# EAGLE design ACNode0_3 (EAGLE 6.1)
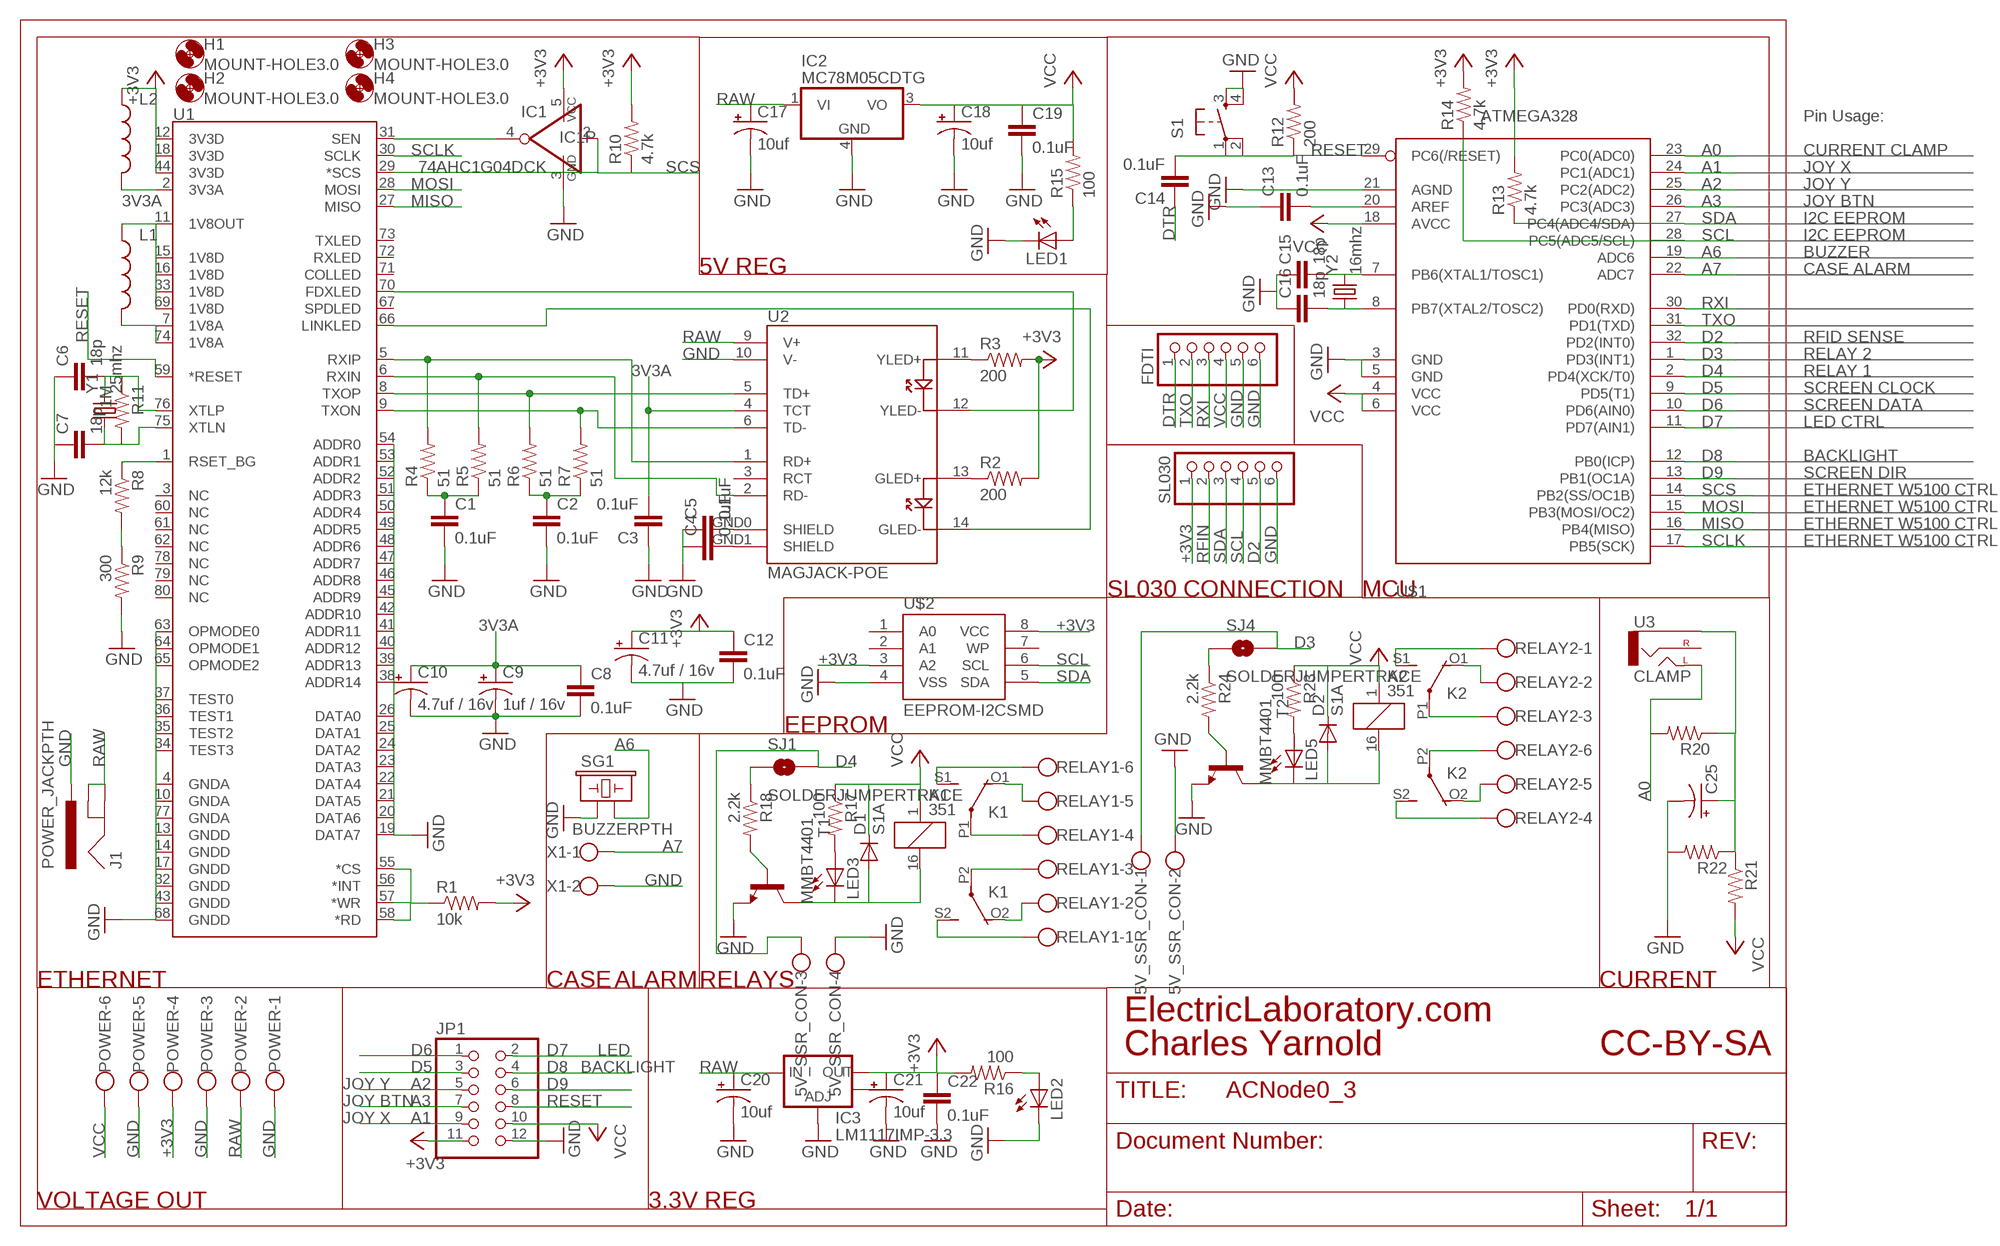
[diagram p0: schematic, sheet 1]

## Parts
5V_SSR_CON  W237-4  [W237-4]
C1  0.1uF  CAP0603-CAP  [0603-CAP]
C2  0.1uF  CAP0603-CAP  [0603-CAP]
C3  0.1uF  CAP0603-CAP  [0603-CAP]
C4  0.1uF  CAP0603-CAP  [0603-CAP]
C5  0.1uF  CAP0603-CAP  [0603-CAP]
C6  18p  CAP0603-CAP  [0603-CAP]
C7  18p  CAP0603-CAP  [0603-CAP]
C8  0.1uF  CAP0603-CAP  [0603-CAP]
C9  1uf / 16v  CAP_POL1206  [EIA3216]
C10  4.7uf / 16v  CAP_POL1206  [EIA3216]
C11  4.7uf / 16v  CAP_POL1206  [EIA3216]
C12  0.1uF  CAP0603-CAP  [0603-CAP]
C13  0.1uF  CAP0603-CAP  [0603-CAP]
C14  0.1uF  CAP0603-CAP  [0603-CAP]
C15  18p  CAP0603-CAP  [0603-CAP]
C16  18p  CAP0603-CAP  [0603-CAP]
C17  10uf  CAP_POL1206  [EIA3216]
C18  10uf  CAP_POL1206  [EIA3216]
C19  0.1uF  CAP0603-CAP  [0603-CAP]
C20  10uf  CAP_POL1206  [EIA3216]
C21  10uf  CAP_POL1206  [EIA3216]
C22  0.1uF  CAP0603-CAP  [0603-CAP]
C25  CAP_POL1206  [EIA3216]
D1  S1A  DIODE-DO-214AC  [DO-214AC]
D2  S1A  DIODE-DO-214AC  [DO-214AC]
FDTI  PINHD-1X6  [1X06]
H1  MOUNT-HOLE3.0  [3,0]
H2  MOUNT-HOLE3.0  [3,0]
H3  MOUNT-HOLE3.0  [3,0]
H4  MOUNT-HOLE3.0  [3,0]
IC1  74AHC1G04DCK  [SC70-5]
IC2  MC78M05CDTG  [DPACK_3]
IC3  LM1117IMP-3.3  V_REG_LM1117SOT223  [SOT223]
J1  POWER_JACKPTH  [POWER_JACK_PTH]
JP1  PINHD-2X6  [2X06]
K1  351  [351]
K2  351  [351]
L1  INDUCTOR1206H*  [INDUCTOR-1206]
L2  INDUCTOR1206H*  [INDUCTOR-1206]
LED1  LED0603  [LED-0603]
LED2  LED0603  [LED-0603]
LED3  LED0603  [LED-0603]
LED5  LED0603  [LED-0603]
POWER  W237-6  [W237-6]
R1  10k  RESISTOR0603-RES  [0603-RES]
R2  200  RESISTOR0603-RES  [0603-RES]
R3  200  RESISTOR0603-RES  [0603-RES]
R4  51  RESISTOR0603-RES  [0603-RES]
R5  51  RESISTOR0603-RES  [0603-RES]
R6  51  RESISTOR0603-RES  [0603-RES]
R7  51  RESISTOR0603-RES  [0603-RES]
R8  12k  RESISTOR0603-RES  [0603-RES]
R9  300  RESISTOR0603-RES  [0603-RES]
R10  4.7k  RESISTOR0603-RES  [0603-RES]
R11  1M  RESISTOR0603-RES  [0603-RES]
R12  200  RESISTOR0603-RES  [0603-RES]
R13  4.7k  RESISTOR0603-RES  [0603-RES]
R14  4.7k  RESISTOR0603-RES  [0603-RES]
R15  100  RESISTOR0603-RES  [0603-RES]
R16  100  RESISTOR0603-RES  [0603-RES]
R17  100  RESISTOR0603-RES  [0603-RES]
R18  2.2k  RESISTOR0603-RES  [0603-RES]
R20  RESISTOR0603-RES  [0603-RES]
R21  RESISTOR0603-RES  [0603-RES]
R22  RESISTOR0603-RES  [0603-RES]
R23  100  RESISTOR0603-RES  [0603-RES]
R24  2.2k  RESISTOR0603-RES  [0603-RES]
RELAY1  W237-6  [W237-6]
RELAY2  W237-6  [W237-6]
S1  TAC_SWITCHSMD  [TACTILE_SWITCH_SMD]
SG1  BUZZERPTH  [BUZZER-12MM]
SJ1  SOLDERJUMPERTRACE  [SJ_2S-TRACE]
SJ4  SOLDERJUMPERTRACE  [SJ_2S-TRACE]
SL030  PINHD-1X6  [1X06]
T1  MMBT4401  MMBT4401LT1-NPN-SOT23-BEC  [SOT23-BEC]
T2  MMBT4401  MMBT4401LT1-NPN-SOT23-BEC  [SOT23-BEC]
U1  W5100  [LQFP-80]
U2  MAGJACK-POE  [MAGJACK-POE]
U3  CLAMP  AUDIO-JACKPTH  [AUDIO-JACK]
U$1  ATMEGA328  AVR-MEGA8-AI  [TQFP32-08]
U$2  EEPROM-I2CSMD  [SO08]
X1  W237-102  [W237-102]
Y1  25mhz  CRYSTALSMD  [HC49UP]
Y2  16mhz  CRYSTALSMD  [HC49UP]

## Nets
3V3A: C3.2 C8.1 C9.A(+) C10.A(+) L2.P$2 U1.2(3V3A) U2.4(TCT)
+3V3: C11.A(+) C12.1 C21.A(+) C22.1 IC1.5(VCC) IC3.2(OUT) JP1.11 L2.P$1 POWER.4 R1.2 R2.2 R3.2 R10.2 R13.2 R14.2 R16.2 SL030.1 U1.12(3V3D) U1.18(3V3D) U1.44(3V3D) U$2.3(A2) U$2.8(VCC)
A0: R20.2 U3.TIP(LEFT) U$1.23(PC0(ADC0))
A1: JP1.9 U$1.24(PC1(ADC1))
A2: JP1.5 U$1.25(PC2(ADC2))
A3: JP1.7 U$1.26(PC3(ADC3))
A6: SG1.- U$1.19(ADC6)
A7: U$1.22(ADC7) X1.1
D2: SL030.5 U$1.32(PD2(INT0))
D3: 5V_SSR_CON.1 SJ4.2 U$1.1(PD3(INT1))
D4: 5V_SSR_CON.3 SJ1.2 U$1.2(PD4(XCK/T0))
D5: JP1.3 U$1.9(PD5(T1))
D6: JP1.1 U$1.10(PD6(AIN0))
D7: JP1.2 U$1.11(PD7(AIN1))
D8: JP1.4 U$1.12(PB0(ICP))
D9: JP1.6 U$1.13(PB1(OC1A))
DTR: C14.1 FDTI.1
GND: 5V_SSR_CON.2 5V_SSR_CON.4 C1.2 C2.2 C3.1 C4.1 C5.1 C6.1 C7.1 C8.2 C9.C(-) C10.C(-) C11.C(-) C12.2 C13.1 C15.1 C16.1 C17.C(-) C18.C(-) C19.2 C20.C(-) C21.C(-) C22.2 C25.C(-) FDTI.5 FDTI.6 IC1.3(GND) IC2.4(GND) IC3.1(ADJ) J1.PWR JP1.12 LED1.C LED2.C POWER.1 POWER.3 POWER.5 R9.2 R22.2 S1.3 S1.4 SG1.+ SL030.6 T1.E T2.E U1.4(GNDA) U1.10(GNDA) U1.13(GNDD) U1.14(GNDD) U1.17(GNDD) U1.19(DATA7) U1.20(DATA6) U1.21(DATA5) U1.22(DATA4) U1.23(DATA3) U1.24(DATA2) U1.25(DATA1) U1.26(DATA0) U1.32(GNDD) U1.34(TEST3) U1.35(TEST2) U1.36(TEST1) U1.37(TEST0) U1.38(ADDR14) U1.39(ADDR13) U1.40(ADDR12) U1.41(ADDR11) U1.42(ADDR10) U1.43(GNDD) U1.45(ADDR9) U1.46(ADDR8) U1.47(ADDR7) U1.48(ADDR6) U1.49(ADDR5) U1.50(ADDR4) U1.51(ADDR3) U1.52(ADDR2) U1.53(ADDR1) U1.54(ADDR0) U1.63(OPMODE0) U1.64(OPMODE1) U1.65(OPMODE2) U1.68(GNDD) U1.77(GNDA) U2.10(V-) U$1.3(GND) U$1.5(GND) U$1.21(AGND) U$2.4(VSS) X1.2
MISO: U1.27(MISO) U$1.16(PB4(MISO))
MOSI: U1.28(MOSI) U$1.15(PB3(MOSI/OC2))
N$1: IC1.4(O) U1.31(SEN)
N$2: C13.2 U$1.20(AREF)
N$3: C2.1 R6.1 R7.1
N$4: C1.1 R4.1 R5.1
N$5: L1.P$2 U1.7(1V8A) U1.74(1V8A)
N$6: L1.P$1 U1.11(1V8OUT) U1.15(1V8D) U1.16(1V8D) U1.33(1V8D) U1.69(1V8D)
N$7: R1.1 U1.55(*CS) U1.57(*WR) U1.58(*RD)
N$8: R8.2 R9.1
N$9: R6.2 U1.8(TXOP) U2.5(TD+)
N$10: R7.2 U1.9(TXON) U2.6(TD-)
N$11: R4.2 U1.5(RXIP) U2.1(RD+)
N$12: R5.2 U1.6(RXIN) U2.2(RD-)
N$13: R3.1 U2.11(YLED+)
N$14: R2.1 U2.13(GLED+)
N$15: R8.1 U1.1(RSET_BG)
N$16: U1.70(FDXLED) U2.12(YLED-)
N$17: U1.66(LINKLED) U2.14(GLED-)
N$18: C5.2 U2.GND0(SHIELD)
N$19: C4.2 U2.GND1(SHIELD)
N$20: C7.2 R11.2 U1.75(XTLN) Y1.1
N$21: C6.2 R11.1 U1.76(XTLP) Y1.2
N$22: C15.2 U$1.7(PB6(XTAL1/TOSC1)) Y2.2
N$23: K2.P1(2:P) RELAY2.3
N$24: C16.2 U$1.8(PB7(XTAL2/TOSC2)) Y2.1
N$25: K1.S2(3:S) RELAY1.1
N$26: LED1.A R15.1
N$27: K1.O2(3:O) RELAY1.2
N$28: LED2.A R16.1
N$29: K1.P2(3:P) RELAY1.3
N$30: K1.P1(2:P) RELAY1.4
N$31: K1.O1(2:O) RELAY1.5
N$32: K1.S1(2:S) RELAY1.6
N$33: LED3.A R17.2
N$34: D1.A K1.16 LED3.C T1.C
N$35: R18.2 T1.B
N$36: K2.P2(3:P) RELAY2.6
N$37: R18.1 SJ1.1
N$40: C25.A(+) R20.1 R21.1 R22.1 U3.SLEEVE
N$42: K2.S2(3:S) RELAY2.4
N$43: K2.O2(3:O) RELAY2.5
N$46: K2.O1(2:O) RELAY2.2
N$47: K2.S1(2:S) RELAY2.1
N$48: LED5.A R23.2
N$49: D2.A K2.16 LED5.C T2.C
N$50: R24.2 T2.B
N$51: R24.1 SJ4.1
RAW: C17.A(+) C20.A(+) IC2.1(VI) IC3.3(IN) J1.GND J1.GNDBREAK POWER.2 U2.9(V+)
RESET: C14.2 JP1.8 R12.1 S1.1 S1.2 U1.59(*RESET) U$1.29(PC6(/RESET))
RFIN: SL030.2
RXI: FDTI.3 U$1.30(PD0(RXD))
SCL: R14.1 SL030.4 U$1.28(PC5(ADC5/SCL)) U$2.6(SCL)
SCLK: U1.30(SCLK) U$1.17(PB5(SCK))
SCS: IC1.2(I) R10.1 U1.29(*SCS) U$1.14(PB2(SS/OC1B))
SDA: R13.1 SL030.3 U$1.27(PC4(ADC4/SDA)) U$2.5(SDA)
TXO: FDTI.2 U$1.31(PD1(TXD))
VCC: C18.A(+) C19.1 D1.C D2.C FDTI.4 IC2.3(VO) JP1.10 K1.1 K2.1 POWER.6 R12.2 R15.2 R17.1 R21.2 R23.1 U$1.4(VCC) U$1.6(VCC) U$1.18(AVCC)
Unconnected: IC3.4(OUT) U1.3(NC) U1.56(*INT) U1.60(NC) U1.61(NC) U1.62(NC) U1.67(SPDLED) U1.71(COLLED) U1.72(RXLED) U1.73(TXLED) U1.78(NC) U1.79(NC) U1.80(NC) U2.3(RCT) U3.RING(RIGHT) U$2.1(A0) U$2.2(A1) U$2.7(WP)

## Notes on the sheet
- Pin Usage:
- CURRENT CLAMP
- JOY X
- JOY Y
- JOY BTN
- I2C EEPROM
- I2C EEPROM
- BUZZER
- 5V REG | CASE ALARM
- RFID SENSE
- RELAY 2
- RELAY 1
- SCREEN CLOCK
- SCREEN DATA
- LED CTRL
- BACKLIGHT
- SCREEN DIR
- ETHERNET W5100 CTRL
- ETHERNET W5100 CTRL
- ETHERNET W5100 CTRL
- ETHERNET W5100 CTRL
- SL030 CONNECTION | MCU
- EEPROM
- ETHERNET | CASE | ALARM | RELAYS | CURRENT
- ElectricLaboratory.com
- LED | Charles Yarnold | CC-BY-SA
- BACKLIGHT
- JOY Y
- JOY BTN
- JOY X
- VOLTAGE OUT | 3.3V REG

## Library data of the parts
5V_SSR_CON = con-wago-500:W237-4: WAGO SCREW CLAMP; OC_FARNELL: unknown; OC_NEWARK: unknown
C1-C8 C12-C16 C19 C22 = SparkFun-Passives:CAP: Capacitor Standard 0603 ceramic capacitor, and 0.1" leaded capacitor.
C9-C11 C17 C18 C20 C21 C25 = SparkFun-Passives:CAP_POL: Capacitor Polarized These are standard SMD and PTH capacitors. Normally 10uF, 47uF, and 100uF in electrolytic and tantalum varieties. Always verify the external diameter of the through hole cap, it varies with capacity, voltage, and manufacturer. The EIA devices should be standard.
D1 D2 = diode:DIODE-: DIODE
FDTI SL030 = pinhead:PINHD-1X6: PIN HEADER
H1-H4 = holes:MOUNT-HOLE: MOUNTING HOLE with drill center marker
IC1 = 74xx-little-de:74*1G04: INVERTER Gate
IC2 = linear:MC78M: 500 mA Positive Voltage Regulators Source: Data sheet <http://www.onsemi.com/pub_link/Collateral/MC78M00-D.PDF>
IC3 = SparkFun-PowerIC:V_REG_LM1117: Voltage Regulator LM1117 Standard adjustable voltage regulator but in SMD form. Spark Fun Electronics SKU : COM-00595
J1 = SparkFun-Connectors:POWER_JACK: Power Jack This is the standard 5.5mm barrel jack for power. The PTH is the most common, proven, reliable, footprint. All others are experimental. The Slot footprint only works if the mill layer is transmitted to the PCB fab house so be warned. Spark Fun Electronics SKU : PRT-00119. Mating wall wart : TOL-00298 (and others)
JP1 = pinhead:PINHD-2X6: PIN HEADER
K1 K2 = relay:351: RELAY 2 x switch, Omron; OC_FARNELL: unknown; OC_NEWARK: unknown
L1 L2 = SparkFun-Passives:INDUCTOR: Inductors Basic Inductor/Choke - 0603 and 1206. Footprints are not proven and vary greatly between part numbers.
LED1-LED3 LED5 = SparkFun-LED:LED: LEDs Standard schematic elements and footprints for 5mm, 3mm, 1206, and 0603 sized LEDs. 5mm - Spark Fun Electronics SKU : COM-00529 (and others)
POWER RELAY1 RELAY2 = con-wago-500:W237-6: WAGO SCREW CLAMP; OC_FARNELL: unknown; OC_NEWARK: unknown
R1-R18 R20-R24 = SparkFun-Passives:RESISTOR: Resistor Basic schematic elements and footprints for 0603, 1206, and PTH resistors.
S1 = SparkFun-Electromechanical:TAC_SWITCH: Momentary Switch Button commonly used for reset or general input. Spark Fun Electronics SKU : COM-00097
SG1 = SparkFun-Electromechanical:BUZZER: Buzzer 12mm Spark Fun Electronics SKU : Comp-Buzzer
SJ1 SJ4 = SparkFun-Passives:SOLDERJUMPER: Solder Jumper Standard SMD solder jumper. Used to automate production. Two varients : Normally Open and Normally Closed are the same, but have different paste layers. NC will have a large amount of paste and should jumper during reflow.
T1 T2 = transistor:*-NPN-: NPN Transistror BF959 corrected 2008.03.06
U1 = SparkFun-DigitalIC:W5100: WIZnet W5100 TCP/IP PHY Embedded Chip See SparkFun catalog # COM-09471 Package: LQFP-80,10x10mm, 0.4mm pitch
U2 = SparkFun-Connectors:MAGJACK-POE: PoE compatible MagJack
U3 = SparkFun-Connectors:AUDIO-JACK: 3.5mm Audio Jack Simple 3.5mm common PCB mount audio jack. SKU: PRT-08032
U$1 = SparkFun-DigitalIC:AVR-MEGA8: MICROCONTROLLER 8 Kbytes FLASH 1 kbytes SRAM 512 bytes EEPROM USART 6-channel 10 bit ADC 2-channel 8 bit ADC
U$2 = SparkFun-DigitalIC:EEPROM-I2C: I2C EEPROM chips, 24LC256 (and others)
X1 = con-wago-500:W237-102: WAGO SCREW CLAMP; MPN: 237-102; OC_FARNELL: unknown; OC_NEWARK: 70K9898
Y1 Y2 = SparkFun-FreqCtrl:CRYSTAL: Various standard crystals. Proven footprints. Spark Fun Electronics SKU : COM-00534

## Board
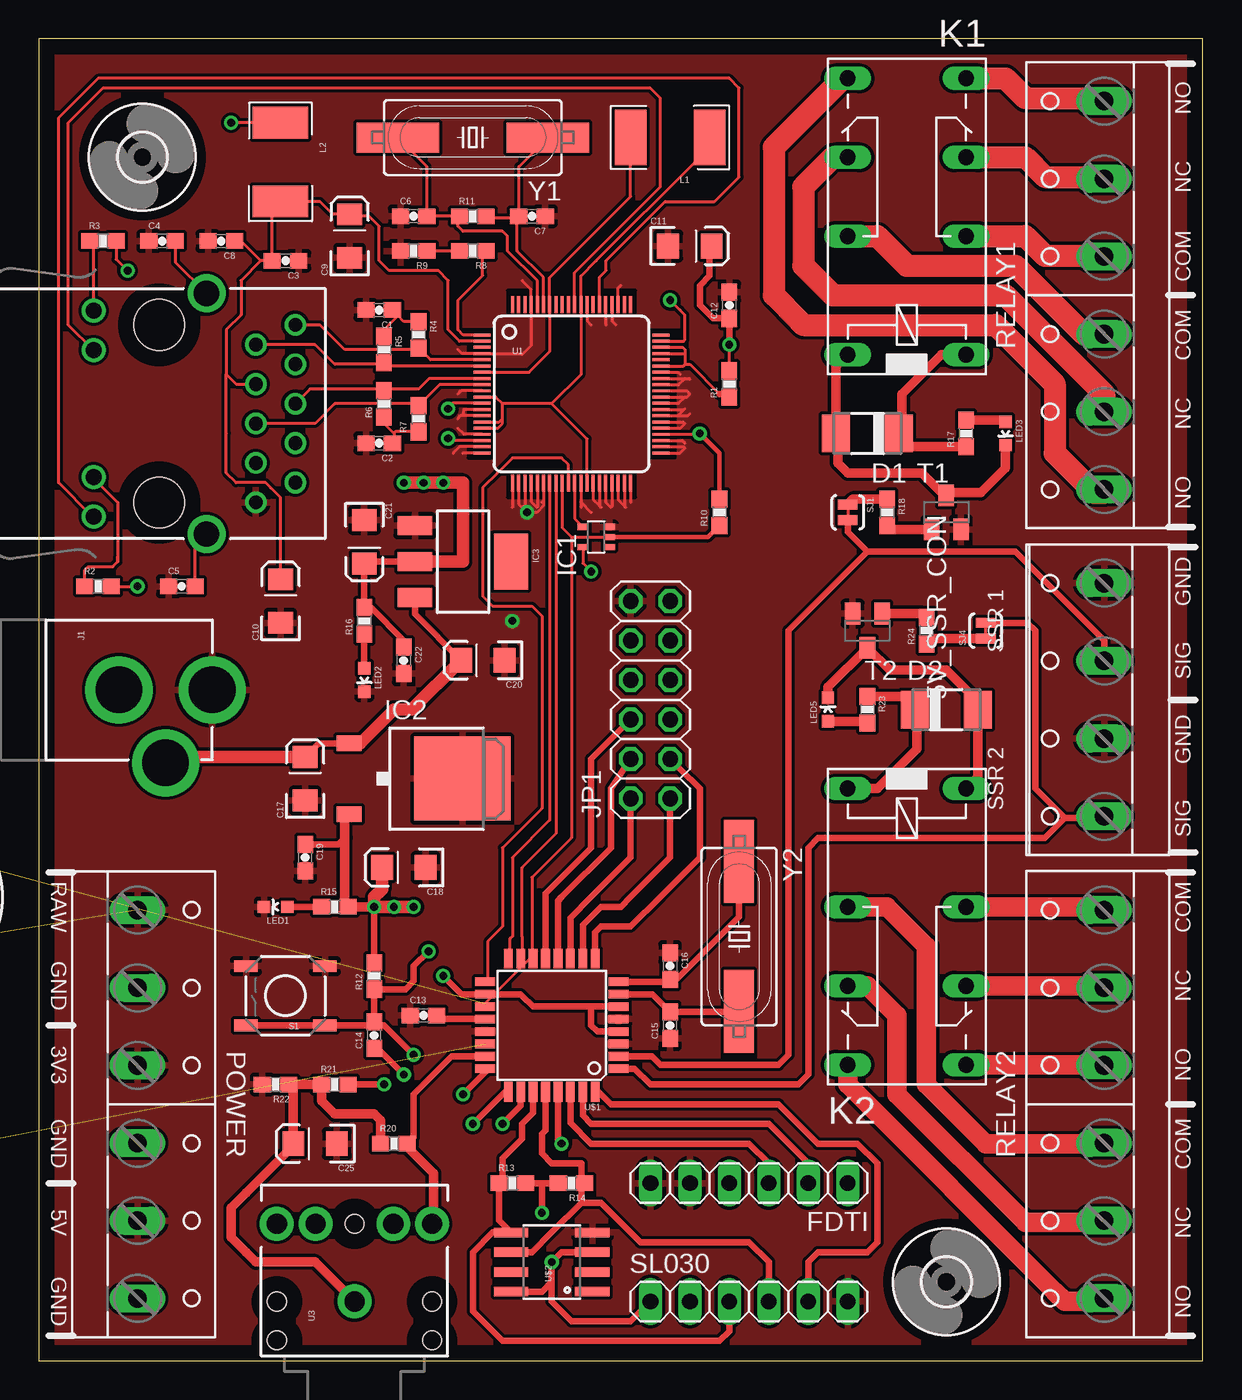
[diagram p1: board, top side]
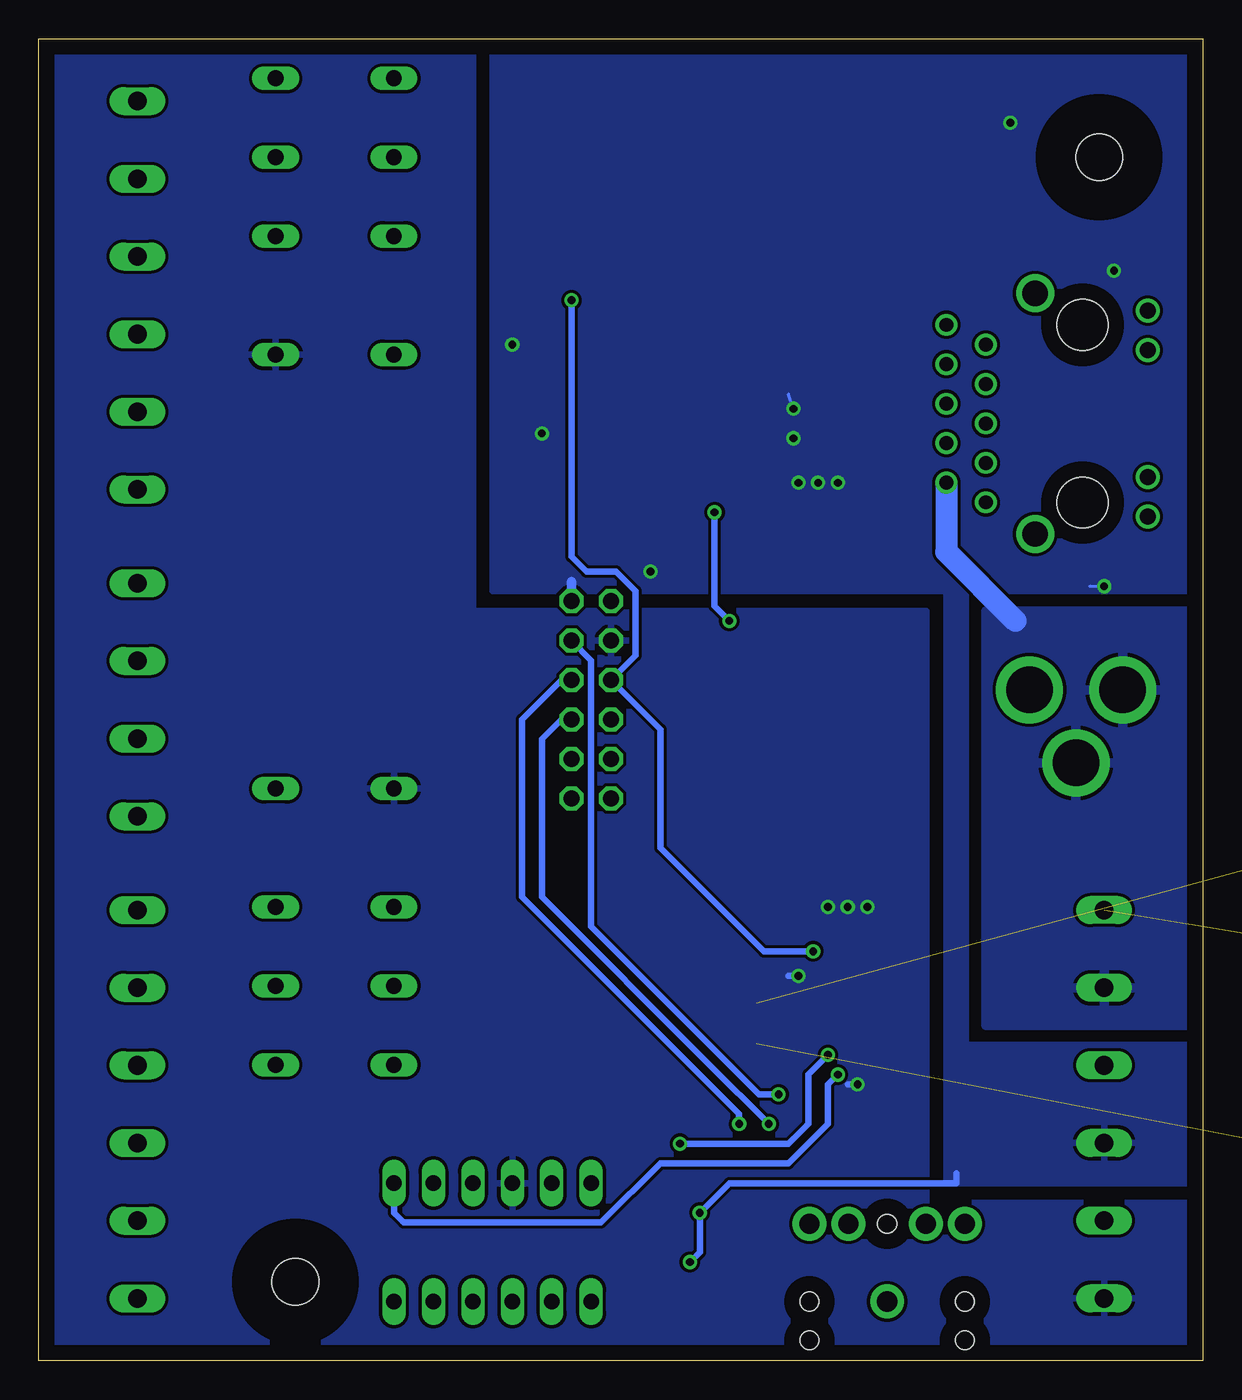
[diagram p2: board, bottom side, seen from below]

Size 74.93 x 85.09 mm. Coordinates in mm from the lower left corner, seen from the top.
Outline: 0,0 74.93,0 74.93,85.09 0,85.09 0,0
Copper layers (1*16): Top 0.035mm / dielectric 1.5mm / Bottom 0.035mm
Design rules: minimum track width 10mil, minimum drill 24mil, track to track 8mil, track to pad 8mil, pad to pad 8mil, via to via 8mil, smd to smd 8mil, copper to edge 40mil, drill to drill 8mil, minimum pad ring 10mil, minimum via ring 8mil, stop-mask expansion 4mil, vias tented up to drill 0mil, thermal gap 10mil
tRestrict: area 27.6,58.1 to 29.2,66.4; area 30.2,67.3 to 38.4,68.9; area 39.4,58.1 to 41,66.4; area 30.2,55.6 to 38.4,57.1

### Footprints (pad centres in the part's own frame; a part is rotated, then mirrored left to right if it is on the bottom)
W237-4 = drill 1.194 long: 1 -7.5,-1.27; 2 -2.5,-1.27; 3 2.5,-1.27; 4 7.5,-1.27
0603-CAP = smd 1.1 x 1: 1 -0.85,0; 2 0.85,0
EIA3216 = smd 1.4 x 1.6: A 1.4,0; C -1.4,0
DO-214AC = smd 1.8 x 2.4: A 2.025,0; C -2.025,0
1X06 = drill 1.016 long: 1 -6.35,0; 2 -3.81,0; 3 -1.27,0; 4 1.27,0; 5 3.81,0; 6 6.35,0
3,0 = hole 3: 0,0
SC70-5 = smd 0.4 x 0.7: 1 -0.65,-0.85; 2 0,-0.85; 3 0.65,-0.85; 4 0.65,0.85; 5 -0.65,0.85
DPACK_3 = smd 1 x 1.6: 1 -2.28,-4.8; 3 2.28,-4.8 | smd 5.4 x 6.2: 4 0,2.5
SOT223 = smd 1.219 x 2.235: 1 -2.311,-3.099; 2 0,-3.099; 3 2.311,-3.099 | smd 3.6 x 2.2: 4 0,3.099
POWER_JACK_PTH = drill 2.997 pad 4.318: GND 0,7.7; GNDBREAK 4.7,10.7; PWR 0,13.7
2X06 = drill 1.016 octagon: 1 -6.35,-1.27; 2 -6.35,1.27; 3 -3.81,-1.27; 4 -3.81,1.27; 5 -1.27,-1.27; 6 -1.27,1.27; 7 1.27,-1.27; 8 1.27,1.27; 9 3.81,-1.27; 10 3.81,1.27; 11 6.35,-1.27; 12 6.35,1.27
351 = drill 1.016 long: 1 -3.81,-3.81; 16 -3.81,3.81; O1 8.89,-3.81; O2 8.89,3.81; P1 3.81,-3.81; P2 3.81,3.81; S1 13.97,-3.81; S2 13.97,3.81
INDUCTOR-1206 = smd 2.032 x 3.556: P$1 -2.54,0; P$2 2.54,0
LED-0603 = smd 0.8 x 0.8: A 0,-0.75; C 0,0.75
W237-6 = drill 1.194 long: 1 -12.5,-1.27; 2 -7.5,-1.27; 3 -2.5,-1.27; 4 2.5,-1.27; 5 7.5,-1.27; 6 12.5,-1.27
0603-RES = smd 1.1 x 1: 1 -0.85,0; 2 0.85,0
TACTILE_SWITCH_SMD = smd 1.524 x 0.762: 1 -2.54,1.905; 2 2.54,1.905; 3 -2.54,-1.905; 4 2.54,-1.905
BUZZER-12MM = drill 0.9 pad 1.778: + 3.25,0; - -3.25,0
SJ_2S-TRACE = smd 0.635 x 1.27: 1 -0.508,0; 2 0.508,0
SOT23-BEC = smd 1 x 1.4: B -0.95,-1.1; C 0,1.1; E 0.95,-1.1
LQFP-80 = smd 0.19 x 1.1: 1 -3.8,-5.75; 2 -3.4,-5.75; 3 -3,-5.75; 4 -2.6,-5.75; 5 -2.2,-5.75; 6 -1.8,-5.75; 7 -1.4,-5.75; 8 -1,-5.75; 9 -0.6,-5.75; 10 -0.2,-5.75; 11 0.2,-5.75; 12 0.6,-5.75; 13 1,-5.75; 14 1.4,-5.75; 15 1.8,-5.75; 16 2.2,-5.75; 17 2.6,-5.75; 18 3,-5.75; 19 3.4,-5.75; 20 3.8,-5.75; 41 3.8,5.75; 42 3.4,5.75; 43 3,5.75; 44 2.6,5.75; 45 2.2,5.75; 46 1.8,5.75; 47 1.4,5.75; 48 1,5.75; 49 0.6,5.75; 50 0.2,5.75; 51 -0.2,5.75; 52 -0.6,5.75; 53 -1,5.75; 54 -1.4,5.75; 55 -1.8,5.75; 56 -2.2,5.75; 57 -2.6,5.75; 58 -3,5.75; 59 -3.4,5.75; 60 -3.8,5.75 | smd 1.1 x 0.19: 21 5.75,-3.8; 22 5.75,-3.4; 23 5.75,-3; 24 5.75,-2.6; 25 5.75,-2.2; 26 5.75,-1.8; 27 5.75,-1.4; 28 5.75,-1; 29 5.75,-0.6; 30 5.75,-0.2; 31 5.75,0.2; 32 5.75,0.6; 33 5.75,1; 34 5.75,1.4; 35 5.75,1.8; 36 5.75,2.2; 37 5.75,2.6; 38 5.75,3; 39 5.75,3.4; 40 5.75,3.8; 61 -5.75,3.8; 62 -5.75,3.4; 63 -5.75,3; 64 -5.75,2.6; 65 -5.75,2.2; 66 -5.75,1.8; 67 -5.75,1.4; 68 -5.75,1; 69 -5.75,0.6; 70 -5.75,0.2; 71 -5.75,-0.2; 72 -5.75,-0.6; 73 -5.75,-1; 74 -5.75,-1.4; 75 -5.75,-1.8; 76 -5.75,-2.2; 77 -5.75,-2.6; 78 -5.75,-3; 79 -5.75,-3.4; 80 -5.75,-3.8
MAGJACK-POE = drill 0.89: 1 5.72,-8.89; 2 4.45,-6.35; 3 3.18,-8.89; 4 1.91,-6.35; 5 0.64,-8.89; 6 -0.63,-6.35; 7 -1.9,-8.89; 8 -3.17,-6.35; 9 -4.44,-8.89; 10 -5.71,-6.35 | drill 1.02: 11 6.625,4.08; 12 4.085,4.08; 13 -4.085,4.08; 14 -6.625,4.08 | drill 1.63: GND0 -7.745,-3.17; GND1 7.745,-3.17 | hole 3.25: -5.715,-0.12; 5.715,-0.12
AUDIO-JACK = drill 1.3 pad 2.184: RING 5,5; RSH 5,2.5; SLEEVE 0,0; TIP 5,-5; TSH 5,-2.5 | hole 1.2: 0,5; -2.5,5; -2.5,-5; 0,-5; 5,0
TQFP32-08 = smd 1.27 x 0.559: 1 -4.293,2.8; 2 -4.293,2; 3 -4.293,1.2; 4 -4.293,0.4; 5 -4.293,-0.4; 6 -4.293,-1.2; 7 -4.293,-2; 8 -4.293,-2.8; 17 4.293,-2.8; 18 4.293,-2; 19 4.293,-1.2; 20 4.293,-0.4; 21 4.293,0.4; 22 4.293,1.2; 23 4.293,2; 24 4.293,2.8 | smd 0.559 x 1.27: 9 -2.8,-4.293; 10 -2,-4.293; 11 -1.2,-4.293; 12 -0.4,-4.293; 13 0.4,-4.293; 14 1.2,-4.293; 15 2,-4.293; 16 2.8,-4.293; 25 2.8,4.293; 26 2,4.293; 27 1.2,4.293; 28 0.4,4.293; 29 -0.4,4.293; 30 -1.2,4.293; 31 -2,4.293; 32 -2.8,4.293
SO08 = smd 0.61 x 2.21: 1 -1.905,-2.616; 2 -0.635,-2.616; 3 0.635,-2.616; 4 1.905,-2.616; 5 1.905,2.616; 6 0.635,2.616; 7 -0.635,2.616; 8 -1.905,2.616
W237-102 = drill 1.194 long: 1 -2.5,-1.27; 2 2.5,-1.27
HC49UP = smd 5.334 x 1.93: 1 -4.826,0; 2 4.826,0

### Placement (x,y rotation side)
5V_SSR_CON  67.31,42.55 90 top
C1  21.91,67.63 180 top
C2  21.91,59.05 180 top
C3  15.88,70.8 180 top
C4  7.94,72.07 0 top
C5  9.21,49.85 0 top
C6  24.13,73.66 0 top
C7  31.75,73.66 180 top
C8  11.75,72.07 180 top
C9  20,72.39 90 top
C10  15.56,48.9 90 top
C11  41.91,71.75 0 top
C12  44.45,67.94 90 top
C13  24.77,22.23 0 top
C14  21.59,20.95 90 top
C15  40.64,21.59 90 top
C16  40.64,25.4 270 top
C17  17.14,37.47 90 top
C18  23.5,31.75 180 top
C19  17.14,32.38 270 top
C20  28.57,45.09 180 top
C21  20.95,52.7 270 top
C22  23.5,45.09 270 top
C25  17.78,13.97 180 top
D1  53.34,59.69 180 top
D2  58.42,41.91 0 top
FDTI  45.72,11.43 180 top
H1  58.42,5.08 0 top
H2  6.67,77.47 0 top
H3  -8.89,41.91 0 top  (outside the outline)
H4  -8.89,52.07 0 top  (outside the outline)
IC1  35.88,53.02 90 top
IC2  24.77,37.47 270 top
IC3  27.3,51.44 270 top
J1  -2.54,43.18 270 top
JP1  39.37,42.55 90 top
K1  55.88,68.58 90 top
K2  55.88,33.02 270 top
L1  40.64,78.74 180 top
L2  15.56,77.15 270 top
LED1  15.24,29.21 90 top
LED2  20.95,43.81 180 top
LED3  62.23,59.69 180 top
LED5  50.8,41.91 0 top
POWER  7.62,16.51 270 top
R1  44.45,62.87 90 top
R2  3.81,49.85 0 top
R3  4.13,72.07 0 top
R4  24.45,66.04 270 top
R5  22.23,65.09 270 top
R6  22.23,61.59 90 top
R7  24.45,60.64 90 top
R8  27.94,71.44 180 top
R9  24.13,71.44 180 top
R10  43.81,54.61 90 top
R11  27.94,73.66 0 top
R12  21.59,24.77 90 top
R13  30.48,11.43 0 top
R14  34.29,11.43 180 top
R15  19.05,29.21 0 top
R16  20.95,47.62 90 top
R17  59.69,59.69 90 top
R18  54.61,54.61 270 top
R20  22.86,13.97 0 top
R21  19.05,17.78 0 top
R22  15.24,17.78 180 top
R23  53.34,41.91 270 top
R24  57.15,46.99 90 top
RELAY1  67.31,68.58 90 top
RELAY2  67.31,16.51 90 top
S1  15.88,23.5 180 top
SG1  -8.26,29.84 270 top  (outside the outline)
SJ1  52.07,54.61 270 top
SJ4  60.96,46.99 90 top
SL030  45.72,3.81 0 top
T1  58.42,54.61 0 top
T2  53.34,46.99 180 top
U1  34.29,62.23 270 top
U2  7.62,60.96 90 top
U3  20.32,3.81 90 top
U$1  33.02,21.59 180 top
U$2  33.02,6.35 90 top
X1  -16.51,8.89 270 top  (outside the outline)
Y1  27.94,78.74 180 top
Y2  45.09,27.3 270 top

### Tracks (layer width: path | path; a pad name or v marks a point on that pad's centre or on a via)
3V3A
  Top 0.178: U1.2 27.08,65.63 26.35,66.36 26.35,69.53 25.72,70.17 22.54,70.17 21.91,70.8 21.91,73.03 21.27,73.66 20.32,73.66 20,73.98 C9.A 18.92,73.79 18.1,74.61 L2.P$2 15.03,74.08 C3.2 14.29,70.8 | 14.29,70.8 13.02,69.53 13.02,67.31 12.06,66.36 12.06,63.5 | 12.06,63.5 12.7,62.87 U2.4 | C8.1 13.02,72.07 14.29,70.8 | C10.A 15.56,51.44 15.56,55.56 14.92,56.2 14.61,56.52 12.7,56.52 12.06,57.15 12.06,59.69 12.06,63.5
+3V3  (via drill 0.5)
  Top 0.178: R1.2 v44.45,65.41 | U1.12 26.64,61.63 v26.35,61.28 | U1.18 26.5,59.23 v26.35,59.37 | L2.P$1 v12.38,79.69 | IC1.5 35.03,51.33 v35.56,50.8 | U1.44 42.48,59.63 v42.55,59.69 | R2.2 v6.35,49.85 | R3.2 4.98,70.91 v5.71,70.17
  Top 0.305: R10.2 43.81,58.42 v42.55,59.69
  Top 0.406: IC3.2 21.09,51.44 C21.A R16.2 21.38,48.48 23.5,46.35 C22.1 | U$2.8 32.38,4.45 33.02,5.08 | 33.02,5.08 v33.02,6.35 33.66,6.99 U$2.3 36.2,6.99 | SL030.1 38.1,2.54 34.29,2.54 33.02,3.81 33.02,5.08 | R13.2 32.38,11.43 | 32.38,11.43 33.02,11.43 | 32.38,11.43 R14.2 32.38,11.43 | 32.38,11.43 v32.38,9.53 | v44.45,65.41 C12.1 43.4,67.09 42.55,67.94 42.55,69.22 43.18,69.85 43.18,71.62 C11.A
  Top 0.813: IC3.2 27.3,51.44 27.3,56.52 v26.04,56.52 v24.77,56.52 v23.5,56.52
  Bottom 0.178: v26.35,61.28 26.67,62.23 | v12.38,79.69 12.38,79.38 | v35.56,50.8 35.88,50.8 | v42.55,59.69 42.23,59.69 | v6.35,49.85 7.3,49.85 | v5.71,70.17 6.03,70.17
  Bottom 0.406: 15.88,12.06 15.88,11.43 30.48,11.43 v32.38,9.53 32.38,6.99 v33.02,6.35
  Bottom 0.61: JP1.11 40.64,50.16
  pour Bottom: 0,85.09 45.72,85.09 45.72,49.53 16.51,49.53 16.51,11.43 0,11.43 0,20.32 15.24,20.32 15.24,49.53 0,49.53
A0
  Top 0.406: 25.5,11.97 25.4,12.06 | U$1.23 26.57,19.59 24.13,17.14 24.13,14.39 R20.2
  Top 0.61: U3.TIP 25.4,8.89 25.4,12.06 23.71,13.76 R20.2
A1  (via drill 0.5)
  Top 0.406: U$1.24 28.73,18.57 v27.3,17.14
  Bottom 0.406: v27.3,17.14 28.57,17.14 30.48,19.05 39.37,27.94 39.37,34.92 39.37,45.09 JP1.9
A2  (via drill 0.5)
  Top 0.406: U$1.25 30,17.3 v27.94,15.24
  Bottom 0.406: v27.94,15.24 31.75,19.05 42.55,29.84 42.55,40.01 41.27,41.27 JP1.5
A3  (via drill 0.5)
  Top 0.406: U$1.26 31.02,16.41 v29.84,15.24
  Bottom 0.406: v29.84,15.24 29.84,15.88 33.02,19.05 43.81,29.84 43.81,41.27 41.27,43.81 JP1.7
A6  (1 unrouted)
  Top 0.178: U$1.19 28.73,23.01 32.07,26.35
A7  (1 unrouted)
D2
  Top 0.406: U$1.32 36.04,17.3 36.83,16.51 47.62,16.51 50.16,13.97 52.7,13.97 53.98,12.7 53.98,12.06 53.98,7.62 53.34,6.99 50.16,6.99 49.53,6.35 SL030.5
D3
  Top 0.406: SJ4.2 63.63,47.5 64.14,46.99 64.14,36.83 66.04,34.92 | 66.04,34.92 68.46,34.92 5V_SSR_CON.1 | U$1.1 38.36,18.79 39.37,17.78 48.9,17.78 49.53,18.41 49.53,33.02 50.16,33.66 64.77,33.66 66.04,34.92
  Top 0.61: 5V_SSR_CON.1 68.58,34.92
D4
  Top 0.406: SJ1.2 52.07,53.34 53.34,52.07 | 53.34,52.07 62.87,52.07 68.58,46.35 5V_SSR_CON.3 | U$1.2 39.47,19.59 40.01,19.05 47.62,19.05 48.26,19.68 48.26,46.99 53.34,52.07
  Top 0.61: 68.54,45.09 5V_SSR_CON.3
D5
  Top 0.406: U$1.9 35.82,27.57 36.2,27.94 38.1,27.94 40.01,29.84 42.55,32.38 42.55,36.83 41.27,38.1 JP1.3
D6
  Top 0.406: U$1.10 35.02,28.04 36.2,29.21 37.47,29.21 38.1,29.84 40.64,32.38 JP1.1
D7
  Top 0.406: U$1.11 34.22,28.5 35.56,29.84 38.1,32.38 JP1.2
D8
  Top 0.406: U$1.12 33.42,29.61 33.66,29.84 36.83,33.02 36.83,36.83 JP1.4
D9
  Top 0.406: U$1.13 32.62,30.08 35.56,33.02 35.56,38.73 JP1.6
DTR  (via drill 0.5)
  Top 0.406: C14.1 21.8,20.11 v23.5,18.41
  Bottom 0.406: v23.5,18.41 24.13,17.78 24.13,15.24 26.67,12.7 34.92,12.7 38.73,8.89 51.44,8.89 52.07,9.53 FDTI.1
GND  (via drill 0.5)  (2 unrouted)
  Top 0.178: U1.13 27.35,61.23 27.3,60.96 | U1.14 27.12,60.83 26.99,60.64 | U1.63 37.29,69.04 37.47,69.22 | U1.54 41.15,63.63 41.27,63.5 | U1.53 41.59,63.23 | 41.59,63.23 41.86,63.23 41.91,63.18 | U1.52 41.19,62.83 41.59,63.23 | U1.51 41.71,62.43 41.91,62.23 41.71,62.03 41.59,62.03 | U1.50 41.59,62.03 | U1.49 41.19,61.63 41.59,62.03 | U1.48 41.55,61.23 | 41.55,61.23 41.59,61.28 | 41.55,61.23 41.15,60.83 U1.47 41.78,60.83 41.91,60.96 | U1.46 41.49,60.43 41.59,60.33 41.3,60.03 U1.45 | U1.42 41.5,58.83 41.59,58.74 41.28,58.43 U1.41 | U1.40 38.09,55.26 38.1,55.24 | U1.39 37.69,55.02 | 37.69,55.02 37.78,54.93 | U1.38 37.29,55.42 37.69,55.02 | U1.37 36.89,54.99 36.83,54.93 36.49,55.27 U1.36 | U1.35 36.09,55.03 | 36.09,55.03 36.2,54.93 | U1.34 35.69,55.43 36.09,55.03 | 34.92,54.93 34.89,54.96 U1.32 34.89,55.28 35.56,54.61 | 32.38,55.24 32.49,55.35 U1.26 32.49,55.03 32.07,54.61 v31.43,54.61 | U1.25 32.09,54.95 32.07,54.93 31.69,55.3 U1.24 | U1.23 31.29,55.1 31.11,54.93 30.89,55.15 U1.22 | U1.21 30.49,54.94 30.48,54.93 | 26.99,65.09 27.25,64.83 U1.4 31.05,64.83 31.11,64.77 31.69,65.34 U1.77 31.69,68.96 31.11,69.53 | U1.10 27.19,62.43 26.99,62.23 | U1.17 27.36,59.63 26.99,60.01 | U1.19 27.08,58.83 26.67,58.42 | U1.20 27.32,58.43 27.3,58.42 | U1.68 35.29,66.94 35.56,66.67 | U1.65 36.49,66.7 36.51,66.67 | U1.64 36.89,66.93 37.15,66.67 | U1.43 41.42,59.23 41.59,59.05
  Top 0.406: v30.48,47.62 30.48,47.31
  Bottom 0.406: v31.43,54.61 31.43,48.58 v30.48,47.62
  pour Top: 0,85.09 74.93,85.09 74.93,0 0,0
MISO
  Top 0.178: U$1.16 30.35,26.01 30.35,27.18 30.48,27.3 30.48,32.38 32.89,34.8 U1.27
MOSI
  Top 0.178: U$1.15 31.11,25.98 31.11,27.3 31.11,31.75 33.02,33.66 33.29,33.92 U1.28
N$1
  Top 0.178: U1.31 34.49,54.21 IC1.4
N$2
  Top 0.406: U$1.20 25.85,21.99 C13.2
N$3
  Top 0.178: R6.1 22.23,60.33 22.86,59.69 | 22.86,59.69 22.86,59.16 C2.1 | R7.1 22.96,59.79 22.86,59.69
N$4
  Top 0.178: R4.1 23.5,66.89 23.13,67.26 | 23.13,67.26 C1.1 | R5.1 22.23,66.36 23.13,67.26
N$5
  Top 0.178: L1.P$2 38.1,74.93 32.89,69.72 U1.74 32.89,64.96 31.56,63.63 U1.7
N$6
  Top 0.178: U1.16 29.55,60.03 29.84,60.33 29.84,60.64 | 29.84,60.64 29.84,61.59 | U1.11 29.41,62.03 29.84,61.59 | U1.15 29.63,60.43 29.84,60.64 | 33.02,61.59 34.89,63.47 U1.69 34.89,69.81 35.88,70.8 42.23,77.15 42.86,77.79 42.86,78.42 L1.P$1 | 33.02,61.59 29.84,61.59 | U1.33 35.29,59.33 33.02,61.59
N$7
  Top 0.178: U1.55 41.49,64.03 41.59,64.14 | U1.58 41.45,65.23 41.59,65.09 41.59,64.77 | 41.59,64.77 41.59,64.14 | U1.57 41.53,64.83 41.59,64.77 | R1.1 44.35,62.23 44.45,62.23 | 41.59,64.14 41.91,64.14 43.81,62.23
  Top 0.406: 43.81,62.23 44.35,62.23 44.45,62.23
N$8
  Top 0.178: R8.2 R9.1
N$9
  Top 0.178: U1.8 25.13,63.23 24.45,62.55 22.33,62.55 R6.2 22.01,62.45 21.91,62.55 17.46,62.55 U2.5
N$10
  Top 0.178: U1.9 25.79,62.83 R7.2 24.23,61.49 24.13,61.59 19.05,61.59 17.78,60.33 U2.6
N$11
  Top 0.178: U1.5 25.21,64.43 R4.2 24.23,65.19 24.13,65.09 19.68,65.09 18.1,66.67 U2.1
N$12
  Top 0.178: U1.6 22.43,64.03 R5.2 22.01,64.24 21.91,64.14 19.05,64.14 17.78,65.41 U2.2
N$13
  Top 0.178: U2.11 3.54,72.03 3.49,72.07 R3.1
N$14
  Top 0.178: U2.13 3.54,56.78 5.08,55.24 5.08,51.75 | 5.08,51.75 5.08,51.44 | 5.08,51.44 5.08,51.75 | 5.08,51.75 5.08,51.44 | R2.1 2.96,50.9 3.17,51.12 4.76,51.12 5.08,51.44
N$15
  Top 0.178: U1.1 27.32,66.03 26.99,66.36 26.99,68.26 28.57,69.85 28.57,71.22 R8.1
N$16
  Top 0.178: U1.70 34.49,70.05 40.01,75.56 40.01,81.28 39.37,81.92 4.13,81.92 1.91,79.69 1.91,66.67 U2.12
N$17
  Top 0.178: U1.66 36.09,69.75 36.51,70.17 36.51,70.8 40.32,74.61 43.5,74.61 45.09,76.2 45.09,81.92 44.45,82.55 3.81,82.55 1.27,80.01 1.27,56.52 3.45,54.34 U2.14
N$18
  Top 0.178: C5.2 10.06,52.6 10.79,53.34 U2.GND0
N$19
  Top 0.178: C4.2 8.79,70.71 U2.GND1
N$20
  Top 0.178: U1.75 32.49,69.75 30.8,71.44 30.8,73.56 | 30.8,73.56 C7.2 30.9,76.87 Y1.1 | 30.8,73.56 28.89,73.56 R11.2
N$21
  Top 0.178: U1.76 32.09,69.51 30.16,71.44 30.16,72.39 29.84,72.71 27.3,72.71 26.99,73.03 26.99,73.56 R11.1 | 27.3,73.44 R11.1 | R11.1 C6.2 24.98,76.87 Y1.2
N$22
  Top 0.406: Y2.2 45.05,22.44 C15.2 39.49,23.59 U$1.7
N$23
  Top 1.27: K2.P1 54.61,29.21 57.15,26.67 57.15,17.78 60.96,13.97 68.54,13.97 RELAY2.3
N$24
  Top 0.406: U$1.8 40.48,24.39 C16.2 41.06,24.55 45.09,28.57 Y2.1
N$25
  Top 1.422: K1.S2 51.75,82.55 47.31,78.11 47.31,68.58 48.9,66.99 49.21,66.67 61.59,66.67 65.41,62.87 65.41,58.42 67.94,55.88 68.58,55.88 RELAY1.1
N$26
  Top 0.406: R15.1 LED1.A
N$27
  Top 1.422: K1.O2 51.12,77.47 49.21,75.56 49.21,70.48 50.8,68.9 51.12,68.58 62.23,68.58 68.58,62.23 RELAY1.2 | RELAY1.2 68.58,60.96 RELAY1.2
N$28
  Top 0.406: R16.1 LED2.A
N$29
  Top 1.422: K1.P2 53.98,72.39 55.56,70.8 55.88,70.48 62.87,70.48 67.31,66.04 68.54,66.04 RELAY1.3
N$30
  Top 1.422: K1.P1 63.5,72.39 64.77,71.12 68.54,71.12 RELAY1.4
N$31
  Top 1.422: K1.O1 63.5,77.47 64.77,76.2 68.46,76.2 RELAY1.5
N$32
  Top 1.422: K1.S1 62.23,82.55 63.5,81.28 68.38,81.28 RELAY1.6
N$33
  Top 0.61: R17.2 62.13,60.54 LED3.A
N$34
  Top 0.61: K1.16 51.31,64.02 D1.A 51.44,59.57 51.44,57.78 52.07,57.15 56.83,57.15 58.27,55.71 T1.C 58.59,55.88 60.64,55.88 62.23,57.47 LED3.C
N$35
  Top 0.61: T1.B 54.86,53.51 R18.2
N$36
  Top 1.27: K2.P2 68.58,29.21 RELAY2.6
N$37
  Top 0.61: R18.1 52.41,55.46 SJ1.1
N$40
  Top 0.61: U3.SLEEVE 17.78,6.35 13.97,6.35 13.34,6.99 12.38,7.94 12.38,9.84 13.34,10.79 16.51,13.97 C25.A 16.38,17.49 R22.1 R21.1 18.2,16.73 19.05,15.88 21.59,15.88 22.01,15.46 R20.1
N$42
  Top 1.27: K2.S2 68.54,19.05 RELAY2.4
N$43
  Top 1.27: K2.O2 68.46,24.13 RELAY2.5
N$46
  Top 1.27: K2.O1 53.34,24.13 55.24,22.23 55.24,17.14 63.5,8.89 68.46,8.89 RELAY2.2
N$47
  Top 1.27: K2.S1 52.07,17.78 65.41,4.45 66.04,3.81 68.38,3.81 RELAY2.1
N$48
  Top 0.61: LED5.A 53.24,41.16 R23.2
N$49
  Top 0.61: LED5.C 50.8,43.35 T2.C 54.78,44.45 58.42,44.45 60.45,42.42 D2.A 60.45,37.59 K2.16 | LED5.C 50.8,42.55 LED5.C
N$50
  Top 0.61: R24.2 56.9,48.09 T2.B
N$51
  Top 0.61: R24.1 57.49,46.48 SJ4.1
RAW
  Top 0.406: IC2.1 18.02,39.74 C17.A | IC3.3 24.21,48.05 C20.A
  Top 0.813: C17.A 8.38,38.87 8.26,38.73 8.26,38.1 8.26,38.38 J1.GNDBREAK | IC2.1 20.7,39.74 22.86,41.91 24,41.91 C20.A
  Bottom 1.422: U2.9 16.51,52.07 12.06,47.62
  pour Bottom: 0,21.59 13.97,21.59 13.97,48.26 0,48.26
RESET  (via drill 0.5)
  Top 0.178: U1.59 40.87,65.63 41.5,65.63 41.59,65.72 41.59,67.31 41.27,67.63 v40.64,68.26
  Top 0.406: S1.2 S1.1 21.38,21.59 C14.2 | C14.2 R12.1 23.6,23.91 24.13,24.45 24.13,25.4 v25.08,26.35 | U$1.29 33.42,14.21 v33.66,13.97 | v24.13,19.68 22.23,21.59 21.8,21.59 C14.2
  Bottom 0.406: v33.66,13.97 33.02,13.97 26.67,13.97 25.4,15.24 25.4,18.41 v24.13,19.68 | v25.08,26.35 28.26,26.35 34.92,33.02 34.92,40.64 JP1.8 36.51,45.4 36.51,49.53 37.78,50.8 39.69,50.8 40.64,51.75 v40.64,68.26
RXI
  Top 0.406: U$1.30 34.22,15.31 35.56,13.97 45.72,13.97 46.99,12.7 FDTI.3
SCL
  Top 0.406: 35.16,11.45 R14.1 | U$2.6 31.75,6.99 33.02,8.26 34.92,10.16 | 34.92,10.16 34.92,11.21 R14.1 | 34.92,10.16 36.2,10.16 38.73,7.62 45.72,7.62 46.99,6.35 SL030.4 | U$1.28 32.62,15.01 32.62,14.84 32.38,14.61 32.38,13.34 33.02,12.7 33.66,12.7 34.92,12.7 34.92,11.64 | 34.92,11.64 R14.1 | 34.92,11.64 R14.1
SCLK
  Top 0.178: U1.30 34.09,57.67 33.66,58.1 30.48,58.1 29.53,57.15 28.57,56.2 28.57,49.21 29.21,48.58 31.75,48.58 32.38,47.94 32.38,35.56 29.84,33.02 29.84,27.94 28.89,26.99 28.89,24.55 U$1.17
SCS
  Top 0.178: U1.29 33.69,53.62 34.29,53.02 | 34.29,53.02 IC1.2 | 31.75,25.95 U$1.14 31.75,25.95 | 34.29,53.02 34.29,33.66 31.75,31.11 31.75,25.95
  Top 0.305: IC1.2 43.08,53.02 R10.1
SDA
  Top 0.406: SL030.3 44.45,1.91 43.81,1.27 29.84,1.27 27.94,3.17 27.94,6.99 29.21,8.26 U$2.5 29.63,9.03 R13.1 29.84,11.64 29.84,13.02 31.11,14.29 31.11,15.24 31.82,15.95 U$1.27
TXO
  Top 0.406: U$1.31 35.02,15.78 35.56,15.24 46.99,15.24 49.53,12.7 FDTI.2
VCC  (via drill 0.5)
  Top 0.178: 19.68,29.21 19.37,28.89 19.58,28.89 R15.2
  Top 0.406: C19.1 19.27,33.23 19.68,33.66 | 19.68,34.91 IC2.3 | 19.68,29.43 R15.2 | U$1.6 35.56,22.79 | 35.56,22.79 31.82,22.79 31.11,23.5 31.02,23.59 U$1.18 27.21,23.59 v26.04,24.77 | R21.2 v22.23,17.78 | U$1.4 35.96,21.19 35.56,21.59 35.56,22.79 | R12.2 v21.59,29.21
  Top 0.61: R17.1 56.22,58.84 D1.C 55.56,59.89 55.56,62.23 58.1,64.77 K1.1 | R23.1 55.55,42.76 D2.C 56.52,41.79 56.52,39.37 53.98,36.83 K2.1 | 19.68,29.43 19.68,33.66 19.68,34.91 IC2.3 | v21.59,29.21 R15.2 19.68,29.21
  Top 0.813: C18.A 22.09,30.35 21.59,29.84 v21.59,29.21 v22.86,29.21 v24.13,29.21
  Bottom 0.406: v22.23,17.78 22.86,17.78 | v26.04,24.77 26.67,24.77
  pour Bottom: 0,0 74.93,0 74.93,85.09 46.99,85.09 46.99,48.26 17.78,48.26 17.78,10.16 0,10.16

### Text on the board
tNames: NO | NC | COM | COM | NC | NO | GND | SSR 1 | SIG | GND | SSR 2 | SIG | RAW | COM | GND | NC | 3V3 | NO | GND | COM | 5V | NC | GND | NO